# Altium project V831_Camera.PrjPcb
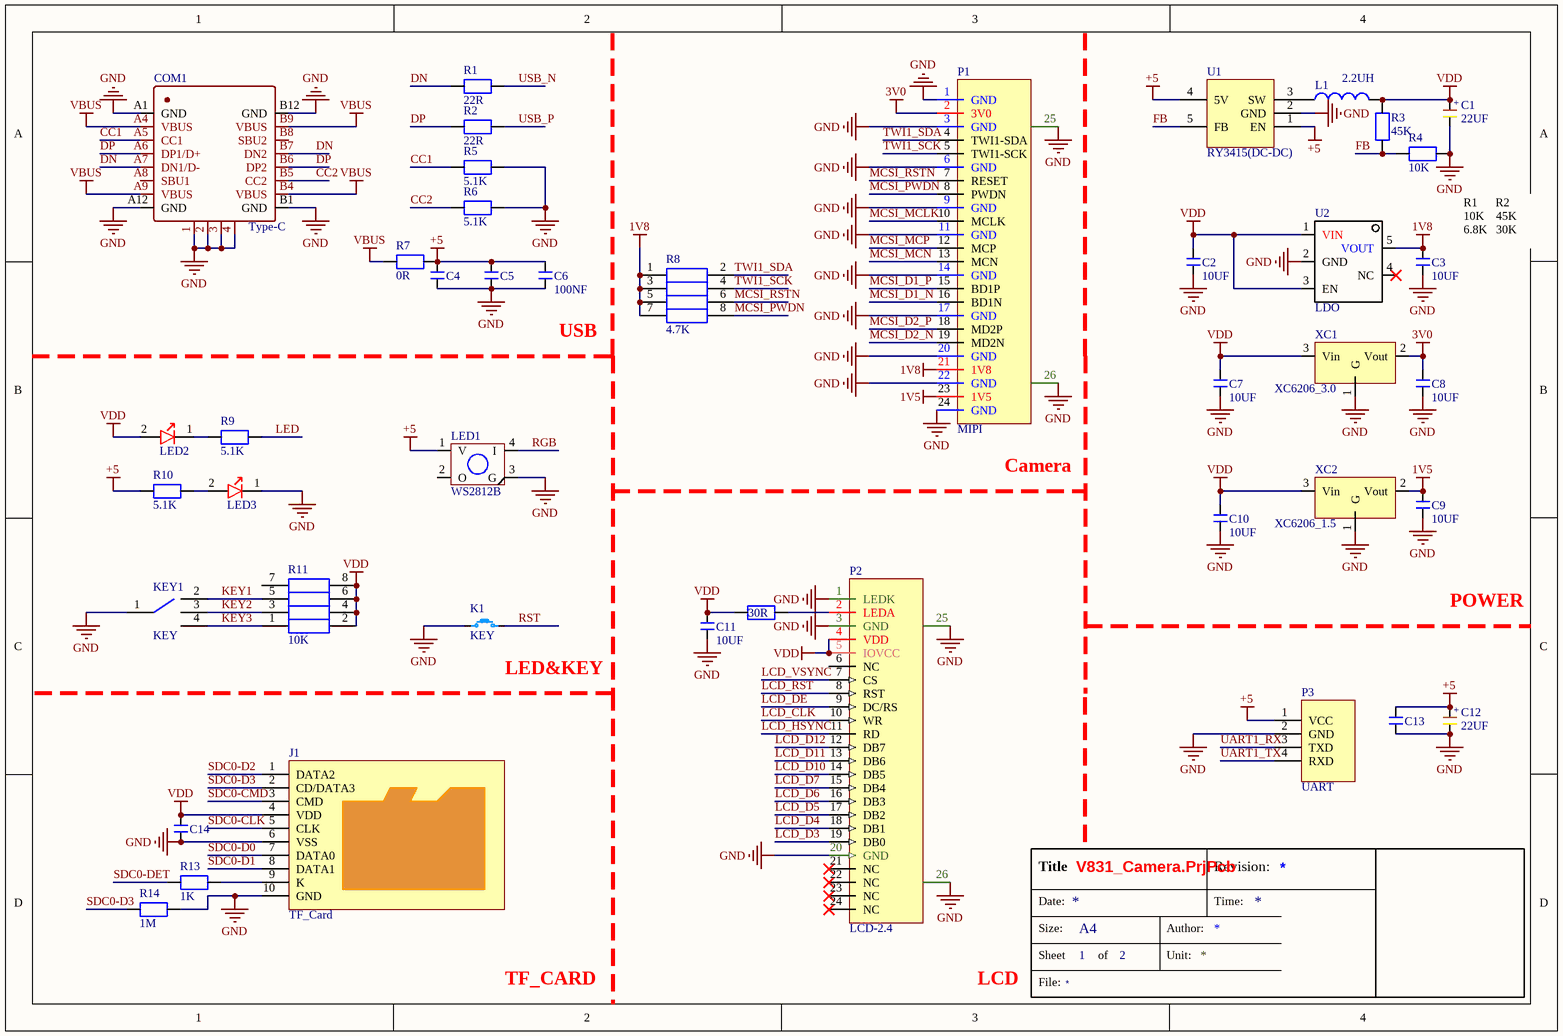
[diagram p0: V831.SchDoc]
2 sheets, 51 parts. Net scope: global (net labels, ports and power ports of the same name join across sheets).
Board file: V831.PcbDoc
Sheets:
  V831.SchDoc
  V831_CORE.SchDoc

## Sheet V831.SchDoc
size A4; SheetNumber: 1; SheetTotal: 2

### Parts
C1  22UF  [CAP_3216_A]
C2  10UF  [CAP_1206]
C3  10UF  [CAP_0603]
C4  100NF  [CAP_0603]  (value not drawn)
C5  100NF  [CAP_0603]  (value not drawn)
C6  100NF  [CAP_0603]
C7  10UF  [CAP_0603]
C8  10UF  [CAP_0603]
C9  10UF  [CAP_0603]
C10  10UF  [CAP_0603]
C11  10UF  [CAP_0603]
C12  22UF  [CAP_3216_A]
C13  100NF  [CAP_0603]  (value not drawn)
C14  100NF  [CAP_0603]  (value not drawn)
COM1  Type-C  [USB-Type-C_16A]
J1  TF_Card  [TF_Card]
K1  KEY  [KEY_SMD-4P]
KEY1  KEY  [KEY-K1-1502SA-LY-K3]
L1  2.2UH  [INDUCTANCE_4*4]
LED1  WS2812B  [WS2812B]
LED2  LED_R/G/B/Y  [LED_0603_B]  (value not drawn)
LED3  LED_R/G/B/Y  [LED_0603_R]  (value not drawn)
P1  MIPI  [FPC-24Pin]
P2  LCD-2.4  [FPC-24PIN-FB]
P3  UART  [XH2.54-WS-4P]
R1  22R  [RESC_0603_2]
R2  22R  [RESC_0603_2]
R3  45K  [RESC_0603_2]
R4  10K  [RESC_0603_2]
R5  5.1K  [RESC_0603_2]
R6  5.1K  [RESC_0603_2]
R7  0R  [RESC_0603_2]
R8  4.7K  [RESC_0603_4]
R9  5.1K  [RESC_0603_2]
R10  5.1K  [RESC_0603_2]
R11  10K  [RESC_0603_4]
R12  30R  [RESC_0603_2]
R13  1K  [RESC_0603_2]
R14  1M  [RESC_0603_2]
U1  RY3415(DC-DC)  [SOT23_5]
U2  LDO  [SOT23_5]
XC1  XC6206_3.0  [SOT23_3]
XC2  XC6206_1.5  [SOT23_3]

### Nets
1V5: C9.2 P1.23(1V5) XC2.2(Vout)
1V8: C3.2 P1.21(1V8) R8.1 R8.3 R8.5 R8.7 U2.5(VOUT)
3V0: C8.2 P1.2(3V0) XC1.2(Vout)
+5: C4.2 C5.2 C6.2 C12.1 C13.2 LED1.1(V) P3.1(VCC) R7.2 R10.1 U1.1(EN) U1.4(5V)
GND: C1.2 C2.1 C3.1 C4.1 C5.1 C6.1 C7.1 C8.1 C9.1 C10.1 C11.1 C12.2 C13.1 C14.1 COM1.1 COM1.2 COM1.3 COM1.4 COM1.A1(GND) COM1.A12(GND) COM1.B1(GND) COM1.B12(GND) J1.6(VSS) J1.10(GND) K1.1 KEY1.1 LED1.3(G) LED3.1(-) P1.1(GND) P1.3(GND) P1.6(GND) P1.9(GND) P1.11(GND) P1.14(GND) P1.17(GND) P1.20(GND) P1.22(GND) P1.24(GND) P1.25(GND) P1.26(GND) P2.1(LEDK) P2.3(GND) P2.20(GND) P2.25(GND) P2.26(GND) P3.2(GND) R4.2 R5.2 R6.2 R14.2 U1.2(GND) U2.2(GND) XC1.1(G) XC2.1(G)
VBUS: COM1.A4(VBUS) COM1.A9(VBUS) COM1.B4(VBUS) COM1.B9(VBUS) R7.1
VDD: C1.1 C2.2 C7.2 C10.2 C11.2 C14.2 J1.4(VDD) L1.2 LED2.2(+) P2.4(VDD) P2.5(IOVCC) R3.1 R11.2 R11.4 R11.6 R11.8 R12.2 U2.1(VIN) U2.3(EN) XC1.3(Vin) XC2.3(Vin)
CC1: COM1.A5(CC1) R5.1
CC2: COM1.B5(CC2) R6.1
DN: COM1.A7(DN1/D-) COM1.B7(DN2) R1.1
DP: COM1.A6(DP1/D+) COM1.B6(DP2) R2.1
FB: R3.2 R4.1 U1.5(FB)
KEY1: KEY1.2 R11.5
KEY2: KEY1.3 R11.3
KEY3: KEY1.4 R11.1
LCD_CLK: P2.10(WR)
LCD_D3: P2.19(DB0)
LCD_D4: P2.18(DB1)
LCD_D5: P2.17(DB2)
LCD_D6: P2.16(DB3)
LCD_D7: P2.15(DB4)
LCD_D10: P2.14(DB5)
LCD_D11: P2.13(DB6)
LCD_D12: P2.12(DB7)
LCD_DE: P2.9(DC/RS)
LCD_HSYNC: P2.11(RD)
LCD_RST: P2.8(RST)
LCD_VSYNC: P2.7(CS)
LED: R9.2
MCSI_D1_N: P1.16(BD1N)
MCSI_D1_P: P1.15(BD1P)
MCSI_D2_N: P1.19(MD2N)
MCSI_D2_P: P1.18(MD2P)
MCSI_MCLK: P1.10(MCLK)
MCSI_MCN: P1.13(MCN)
MCSI_MCP: P1.12(MCP)
MCSI_PWDN: P1.8(PWDN) R8.8
MCSI_RSTN: P1.7(RESET) R8.6
RGB: LED1.4(I)
RST: K1.2
SDC0-CLK: J1.5(CLK)
SDC0-CMD: J1.3(CMD)
SDC0-D0: J1.7(DATA0)
SDC0-D1: J1.8(DATA1)
SDC0-D2: J1.1(DATA2)
SDC0-D3: J1.2(CD/DATA3) R14.1
SDC0-DET: R13.1
TWI1_SCK: P1.5(TWI1-SCK) R8.4
TWI1_SDA: P1.4(TWI1-SDA) R8.2
UART1_RX: P3.3(TXD)
UART1_TX: P3.4(RXD)
USB_N: R1.2
USB_P: R2.2
NetJ1_9: J1.9(K) R13.2
NetL1_1: L1.1 U1.3(SW)
NetLED2_1: LED2.1(-) R9.1
NetLED3_2: LED3.2(+) R10.2
NetP2_2: P2.2(LEDA) R12.1

Not connected (* = marked no-connect by the designer): COM1 A8(SBU1) B8(SBU2); LED1 2(O); P2 6(NC) 21(NC)* 22(NC)* 23(NC)* 24(NC)*; R11 7; U2 4(NC)*

### Notes on the sheet
- R1      R2
  10K    45K
  6.8K   30K
- (near C6) USB
- (near P1) Camera
- POWER
- (near K1) LED&KEY
- TF_CARD
- LCD
- Title
- Date:
- Revision:
- Time:
- File:
- Size:
- Sheet
- A4
- of
- Author:
- Unit:
- (in symbol CAP_TA) +

### Library data of the parts
C1 C12 = CAP_TA: CAP  6~12V  钽电容
C2-C11 C13 C14 = CAP: CAP  12~50V
COM1 = USB-type_c: USB
J1 = TF_Card: TF卡座
KEY1 = LY-K3
L1 = Inductor: Code_IEC: 1005; Published: 8-Jun-2000; LatestRevisionDate: 29-May-2009; LatestRevisionNote: IPC-7351 Footprint Added.; PackageReference: 0402-A; Publisher: Altium Limited; PackageDescription: Chip Inductor; Code_JEITA: 0402
LED1 = WS2812B: LED
LED2 LED3 = LED_SMT: LED
P1 = MIPI: OV2465&VS3205
P2 = LCD-ST7789-Pin24: Show 2.4-2.8寸
P3 = UART: Header
R1-R7 R9 R10 R12-R14 = RES: RES 贴片
R8 R11 = RES_P4: RES
U1 = RY3415
U2 = LDO_SOT23-5: LDO  3.3V  500ma
XC1 XC2 = XC6206: DC-DC

## Sheet V831_CORE.SchDoc
size A4; SheetNumber: 2; SheetTotal: 2
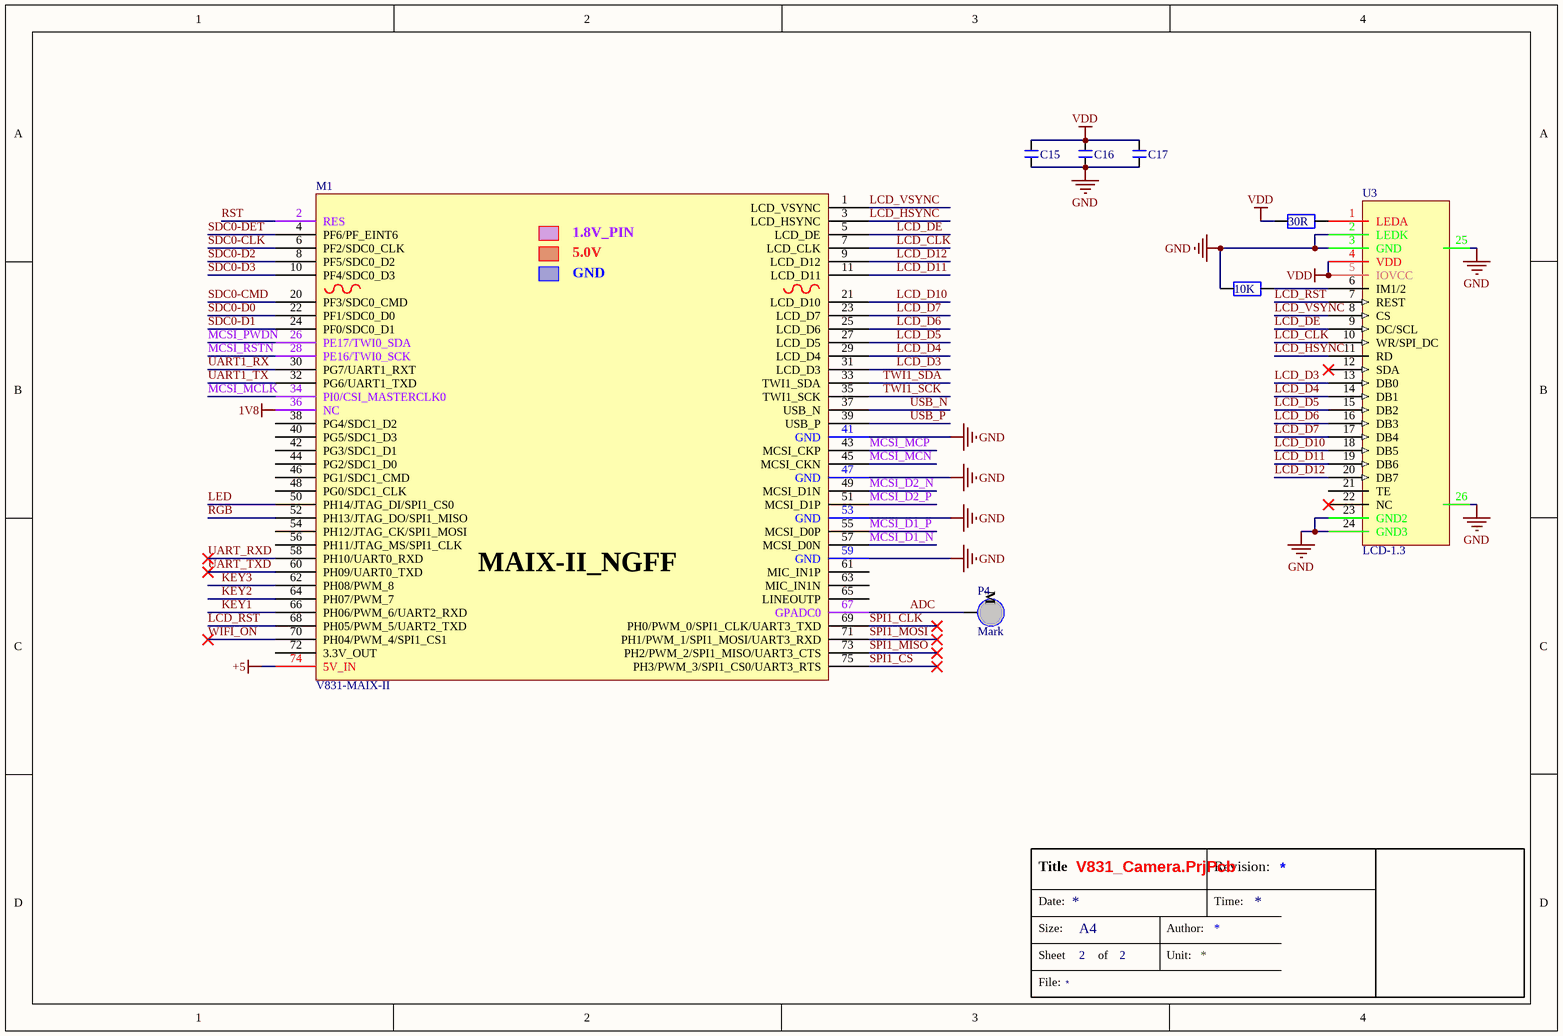
[diagram p1: V831_CORE.SchDoc]

### Parts
C15  100NF  [CAP_0603]  (value not drawn)
C16  100NF  [CAP_0603]  (value not drawn)
C17  100NF  [CAP_0603]  (value not drawn)
M1  V831-MAIX-II  [V831_NAIX-II]
P4  Mark  [Mark]
R15  30R  [RESC_0603_2]
R16  10K  [RESC_0603_2]
U3  LCD-1.3  [FPC-24PIN-FB-Mirror]

### Nets
1V8: M1.36(NC)
+5: M1.74(5V_IN)
GND: C15.1 C16.1 C17.1 M1.41(GND) M1.47(GND) M1.53(GND) M1.59(GND) R16.2 U3.2(LEDK) U3.3(GND) U3.23(GND2) U3.24(GND3) U3.25(GND) U3.26(GND)
VDD: C15.2 C16.2 C17.2 R15.2 U3.4(VDD) U3.5(IOVCC)
ADC: M1.67(GPADC0) P4.1
KEY1: M1.66(PH06/PWM_6/UART2_RXD)
KEY2: M1.64(PH07/PWM_7)
KEY3: M1.62(PH08/PWM_8)
LCD_CLK: M1.7(LCD_CLK) U3.10(WR/SPI_DC)
LCD_D3: M1.31(LCD_D3) U3.13(DB0)
LCD_D4: M1.29(LCD_D4) U3.14(DB1)
LCD_D5: M1.27(LCD_D5) U3.15(DB2)
LCD_D6: M1.25(LCD_D6) U3.16(DB3)
LCD_D7: M1.23(LCD_D7) U3.17(DB4)
LCD_D10: M1.21(LCD_D10) U3.18(DB5)
LCD_D11: M1.11(LCD_D11) U3.19(DB6)
LCD_D12: M1.9(LCD_D12) U3.20(DB7)
LCD_DE: M1.5(LCD_DE) U3.9(DC/SCL)
LCD_HSYNC: M1.3(LCD_HSYNC) U3.11(RD)
LCD_RST: M1.68(PH05/PWM_5/UART2_TXD) U3.7(REST)
LCD_VSYNC: M1.1(LCD_VSYNC) U3.8(CS)
LED: M1.50(PH14/JTAG_DI/SPI1_CS0)
MCSI_D1_N: M1.57(MCSI_D0N)
MCSI_D1_P: M1.55(MCSI_D0P)
MCSI_D2_N: M1.49(MCSI_D1N)
MCSI_D2_P: M1.51(MCSI_D1P)
MCSI_MCLK: M1.34(PI0/CSI_MASTERCLK0)
MCSI_MCN: M1.45(MCSI_CKN)
MCSI_MCP: M1.43(MCSI_CKP)
MCSI_PWDN: M1.26(PE17/TWI0_SDA)
MCSI_RSTN: M1.28(PE16/TWI0_SCK)
RGB: M1.52(PH13/JTAG_DO/SPI1_MISO)
RST: M1.2(RES)
SDC0-CLK: M1.6(PF2/SDC0_CLK)
SDC0-CMD: M1.20(PF3/SDC0_CMD)
SDC0-D0: M1.22(PF1/SDC0_D0)
SDC0-D1: M1.24(PF0/SDC0_D1)
SDC0-D2: M1.8(PF5/SDC0_D2)
SDC0-D3: M1.10(PF4/SDC0_D3)
SDC0-DET: M1.4(PF6/PF_EINT6)
SPI1_CLK: M1.69(PH0/PWM_0/SPI1_CLK/UART3_TXD)
SPI1_CS: M1.75(PH3/PWM_3/SPI1_CS0/UART3_RTS)
SPI1_MISO: M1.73(PH2/PWM_2/SPI1_MISO/UART3_CTS)
SPI1_MOSI: M1.71(PH1/PWM_1/SPI1_MOSI/UART3_RXD)
TWI1_SCK: M1.35(TWI1_SCK)
TWI1_SDA: M1.33(TWI1_SDA)
UART1_RX: M1.30(PG7/UART1_RXT)
UART1_TX: M1.32(PG6/UART1_TXD)
UART_RXD: M1.58(PH10/UART0_RXD)
UART_TXD: M1.60(PH09/UART0_TXD)
USB_N: M1.37(USB_N)
USB_P: M1.39(USB_P)
WIFI_ON: M1.70(PH04/PWM_4/SPI1_CS1)
NetR15_1: R15.1 U3.1(LEDA)
NetR16_1: R16.1 U3.6(IM1/2)

Not connected (* = marked no-connect by the designer): M1 38(PG4/SDC1_D2) 40(PG5/SDC1_D3) 42(PG3/SDC1_D1) 44(PG2/SDC1_D0) 46(PG1/SDC1_CMD) 48(PG0/SDC1_CLK) 54(PH12/JTAG_CK/SPI1_MOSI) 56(PH11/JTAG_MS/SPI1_CLK) 61(MIC_IN1P) 63(MIC_IN1N) 65(LINEOUTP) 72(3.3V_OUT); U3 12(SDA)* 21(TE) 22(NC)*

### Notes on the sheet
- Title
- Date:
- Revision:
- Time:
- File:
- Size:
- Sheet
- A4
- of
- Author:
- Unit:
- (in symbol Mark) M
- (in symbol V831_MAIX-II) 1.8V_PIN; 5.0V; MAIX-II_NGFF

### Library data of the parts
C15-C17 = CAP: CAP  12~50V
M1 = V831_MAIX-II: Sipeed-v831-M2dock
R15 R16 = RES: RES 贴片
U3 = LCD_1.3: SHOW  24Pin

## Nets that join several sheets
1V8: V831 (7 pins), V831_CORE (M1.36)
+5: V831 (11 pins), V831_CORE (M1.74)
GND: V831 (54 pins), V831_CORE (14 pins)
VDD: V831 (21 pins), V831_CORE (6 pins)
KEY1: V831 (KEY1.2 R11.5), V831_CORE (M1.66)
KEY2: V831 (KEY1.3 R11.3), V831_CORE (M1.64)
KEY3: V831 (KEY1.4 R11.1), V831_CORE (M1.62)
LCD_CLK: V831 (P2.10), V831_CORE (M1.7 U3.10)
LCD_D3: V831 (P2.19), V831_CORE (M1.31 U3.13)
LCD_D4: V831 (P2.18), V831_CORE (M1.29 U3.14)
LCD_D5: V831 (P2.17), V831_CORE (M1.27 U3.15)
LCD_D6: V831 (P2.16), V831_CORE (M1.25 U3.16)
LCD_D7: V831 (P2.15), V831_CORE (M1.23 U3.17)
LCD_D10: V831 (P2.14), V831_CORE (M1.21 U3.18)
LCD_D11: V831 (P2.13), V831_CORE (M1.11 U3.19)
LCD_D12: V831 (P2.12), V831_CORE (M1.9 U3.20)
LCD_DE: V831 (P2.9), V831_CORE (M1.5 U3.9)
LCD_HSYNC: V831 (P2.11), V831_CORE (M1.3 U3.11)
LCD_RST: V831 (P2.8), V831_CORE (M1.68 U3.7)
LCD_VSYNC: V831 (P2.7), V831_CORE (M1.1 U3.8)
LED: V831 (R9.2), V831_CORE (M1.50)
MCSI_D1_N: V831 (P1.16), V831_CORE (M1.57)
MCSI_D1_P: V831 (P1.15), V831_CORE (M1.55)
MCSI_D2_N: V831 (P1.19), V831_CORE (M1.49)
MCSI_D2_P: V831 (P1.18), V831_CORE (M1.51)
MCSI_MCLK: V831 (P1.10), V831_CORE (M1.34)
MCSI_MCN: V831 (P1.13), V831_CORE (M1.45)
MCSI_MCP: V831 (P1.12), V831_CORE (M1.43)
MCSI_PWDN: V831 (P1.8 R8.8), V831_CORE (M1.26)
MCSI_RSTN: V831 (P1.7 R8.6), V831_CORE (M1.28)
RGB: V831 (LED1.4), V831_CORE (M1.52)
RST: V831 (K1.2), V831_CORE (M1.2)
SDC0-CLK: V831 (J1.5), V831_CORE (M1.6)
SDC0-CMD: V831 (J1.3), V831_CORE (M1.20)
SDC0-D0: V831 (J1.7), V831_CORE (M1.22)
SDC0-D1: V831 (J1.8), V831_CORE (M1.24)
SDC0-D2: V831 (J1.1), V831_CORE (M1.8)
SDC0-D3: V831 (J1.2 R14.1), V831_CORE (M1.10)
SDC0-DET: V831 (R13.1), V831_CORE (M1.4)
TWI1_SCK: V831 (P1.5 R8.4), V831_CORE (M1.35)
TWI1_SDA: V831 (P1.4 R8.2), V831_CORE (M1.33)
UART1_RX: V831 (P3.3), V831_CORE (M1.30)
UART1_TX: V831 (P3.4), V831_CORE (M1.32)
USB_N: V831 (R1.2), V831_CORE (M1.37)
USB_P: V831 (R2.2), V831_CORE (M1.39)